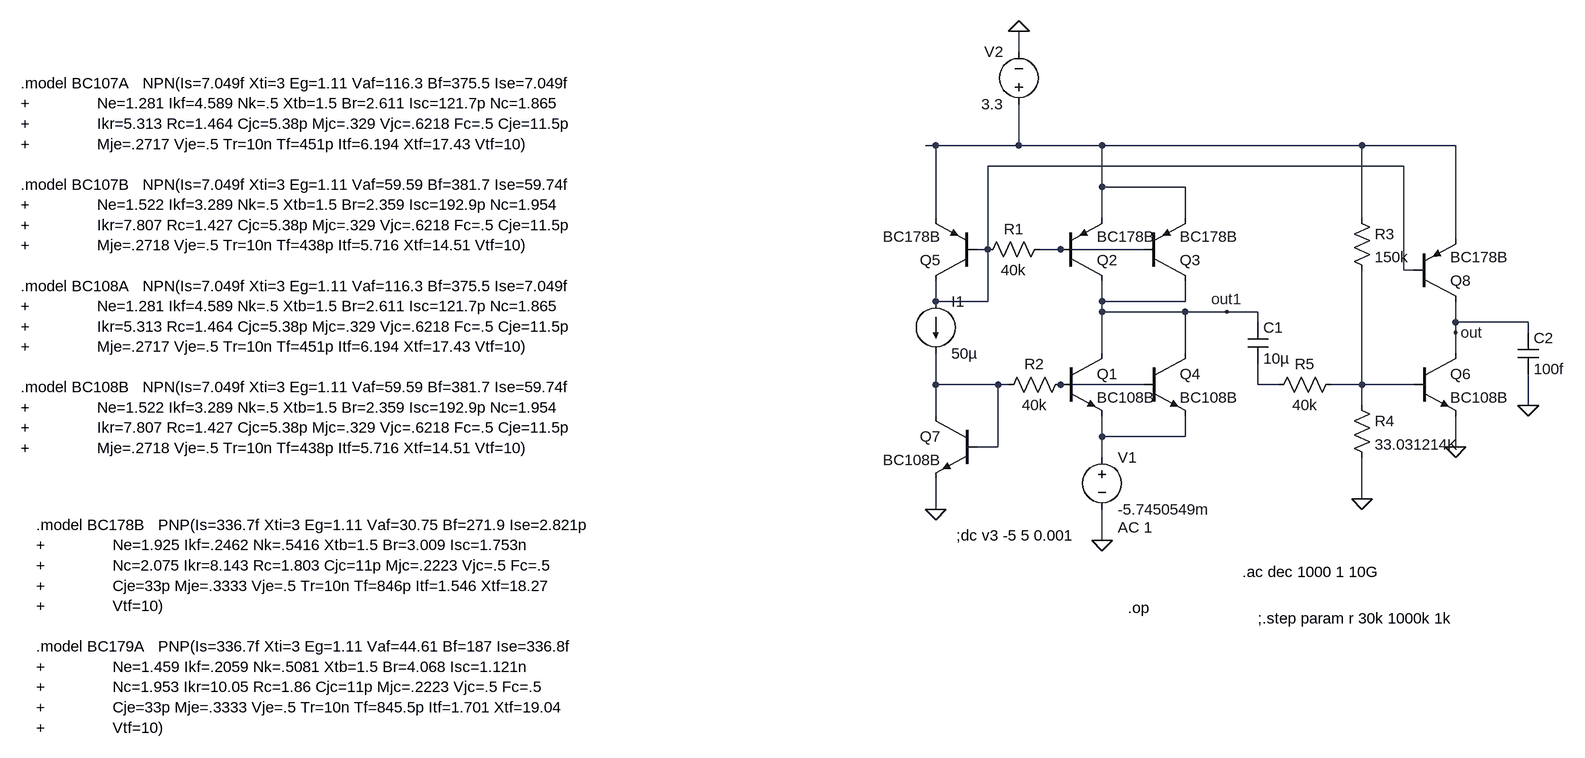
[diagram p0: schematic BJT.asc]
BJT.asc, the LTspice schematic file:
Version 4
SHEET 1 1180 704
WIRE 112 -320 112 -352
WIRE -16 -176 -32 -176
WIRE 112 -176 112 -240
WIRE 112 -176 -16 -176
WIRE 240 -176 112 -176
WIRE 640 -176 240 -176
WIRE 784 -176 640 -176
WIRE 704 -144 64 -144
WIRE 240 -112 240 -176
WIRE 368 -112 240 -112
WIRE -16 -64 -16 -176
WIRE 240 -64 240 -112
WIRE 368 -64 368 -112
WIRE 640 -64 640 -176
WIRE 784 -32 784 -176
WIRE 64 -16 64 -144
WIRE 64 -16 48 -16
WIRE 176 -16 144 -16
WIRE 304 -16 176 -16
WIRE 704 16 704 -144
WIRE 720 16 704 16
WIRE -16 64 -16 32
WIRE 64 64 64 -16
WIRE 64 64 -16 64
WIRE 240 64 240 32
WIRE 368 64 368 32
WIRE 368 64 240 64
WIRE 240 80 240 64
WIRE 368 80 240 80
WIRE 432 80 368 80
WIRE 480 80 432 80
WIRE 480 96 480 80
WIRE 784 96 784 64
WIRE 896 96 784 96
WIRE 784 112 784 96
WIRE 896 112 896 96
WIRE 240 144 240 80
WIRE 368 144 368 80
WIRE 784 144 784 112
WIRE -16 192 -16 144
WIRE 80 192 -16 192
WIRE 96 192 80 192
WIRE 304 192 176 192
WIRE 480 192 480 160
WIRE 512 192 480 192
WIRE 640 192 640 16
WIRE 640 192 592 192
WIRE 720 192 640 192
WIRE 640 224 640 192
WIRE 896 224 896 176
WIRE -16 240 -16 192
WIRE 240 272 240 240
WIRE 368 272 368 240
WIRE 368 272 240 272
WIRE 80 288 80 192
WIRE 80 288 48 288
WIRE 784 288 784 240
WIRE 240 304 240 272
WIRE 640 368 640 304
WIRE -16 384 -16 336
WIRE 240 432 240 384
FLAG 240 432 0
FLAG -16 384 0
FLAG 112 -352 0
FLAG 784 288 0
FLAG 640 368 0
FLAG 432 80 out1
FLAG 784 112 out
FLAG 896 224 0
SYMBOL npn 176 144 R0
SYMATTR InstName Q1
SYMATTR Value BC108B
SYMBOL pnp 176 32 M180
SYMATTR InstName Q2
SYMATTR Value BC178B
SYMBOL voltage 240 288 R0
WINDOW 123 24 124 Left 2
WINDOW 39 0 0 Left 0
SYMATTR Value2 AC 1
SYMATTR InstName V1
SYMATTR Value -5.7450549m
SYMBOL res 160 -32 R90
WINDOW 0 0 56 VBottom 2
WINDOW 3 32 56 VTop 2
SYMATTR InstName R1
SYMATTR Value 40k
SYMBOL pnp 48 32 R180
SYMATTR InstName Q5
SYMATTR Value BC178B
SYMBOL current -16 64 R0
WINDOW 123 0 0 Left 0
WINDOW 39 0 0 Left 0
SYMATTR InstName I1
SYMATTR Value 50µ
SYMBOL npn 48 240 M0
SYMATTR InstName Q7
SYMATTR Value BC108B
SYMBOL res 192 176 R90
WINDOW 0 0 56 VBottom 2
WINDOW 3 32 56 VTop 2
SYMATTR InstName R2
SYMATTR Value 40k
SYMBOL voltage 112 -224 R180
WINDOW 0 24 96 Left 2
WINDOW 3 24 16 Left 2
WINDOW 123 0 0 Left 0
WINDOW 39 0 0 Left 0
SYMATTR InstName V2
SYMATTR Value 3.3
SYMBOL pnp 304 32 M180
SYMATTR InstName Q3
SYMATTR Value BC178B
SYMBOL npn 304 144 R0
SYMATTR InstName Q4
SYMATTR Value BC108B
SYMBOL npn 720 144 R0
SYMATTR InstName Q6
SYMATTR Value BC108B
SYMBOL pnp 720 64 M180
SYMATTR InstName Q8
SYMATTR Value BC178B
SYMBOL res 624 -80 R0
SYMATTR InstName R3
SYMATTR Value 150k
SYMBOL res 624 208 R0
SYMATTR InstName R4
SYMATTR Value 33.031214K
SYMBOL res 608 176 R90
WINDOW 0 0 56 VBottom 2
WINDOW 3 32 56 VTop 2
SYMATTR InstName R5
SYMATTR Value 40k
SYMBOL cap 464 96 R0
SYMATTR InstName C1
SYMATTR Value 10µ
SYMBOL cap 880 112 R0
SYMATTR InstName C2
SYMATTR Value 100f
TEXT -1424 -272 Left 2 !.model BC107A   NPN(Is=7.049f Xti=3 Eg=1.11 Vaf=116.3 Bf=375.5 Ise=7.049f\n+               Ne=1.281 Ikf=4.589 Nk=.5 Xtb=1.5 Br=2.611 Isc=121.7p Nc=1.865\n+               Ikr=5.313 Rc=1.464 Cjc=5.38p Mjc=.329 Vjc=.6218 Fc=.5 Cje=11.5p\n+               Mje=.2717 Vje=.5 Tr=10n Tf=451p Itf=6.194 Xtf=17.43 Vtf=10)\n \n.model BC107B   NPN(Is=7.049f Xti=3 Eg=1.11 Vaf=59.59 Bf=381.7 Ise=59.74f\n+               Ne=1.522 Ikf=3.289 Nk=.5 Xtb=1.5 Br=2.359 Isc=192.9p Nc=1.954\n+               Ikr=7.807 Rc=1.427 Cjc=5.38p Mjc=.329 Vjc=.6218 Fc=.5 Cje=11.5p\n+               Mje=.2718 Vje=.5 Tr=10n Tf=438p Itf=5.716 Xtf=14.51 Vtf=10)\n \n.model BC108A   NPN(Is=7.049f Xti=3 Eg=1.11 Vaf=116.3 Bf=375.5 Ise=7.049f\n+               Ne=1.281 Ikf=4.589 Nk=.5 Xtb=1.5 Br=2.611 Isc=121.7p Nc=1.865\n+               Ikr=5.313 Rc=1.464 Cjc=5.38p Mjc=.329 Vjc=.6218 Fc=.5 Cje=11.5p\n+               Mje=.2717 Vje=.5 Tr=10n Tf=451p Itf=6.194 Xtf=17.43 Vtf=10)\n \n.model BC108B   NPN(Is=7.049f Xti=3 Eg=1.11 Vaf=59.59 Bf=381.7 Ise=59.74f\n+               Ne=1.522 Ikf=3.289 Nk=.5 Xtb=1.5 Br=2.359 Isc=192.9p Nc=1.954\n+               Ikr=7.807 Rc=1.427 Cjc=5.38p Mjc=.329 Vjc=.6218 Fc=.5 Cje=11.5p\n+               Mje=.2718 Vje=.5 Tr=10n Tf=438p Itf=5.716 Xtf=14.51 Vtf=10)
TEXT -1400 408 Left 2 !.model BC178B   PNP(Is=336.7f Xti=3 Eg=1.11 Vaf=30.75 Bf=271.9 Ise=2.821p\n+               Ne=1.925 Ikf=.2462 Nk=.5416 Xtb=1.5 Br=3.009 Isc=1.753n\n+               Nc=2.075 Ikr=8.143 Rc=1.803 Cjc=11p Mjc=.2223 Vjc=.5 Fc=.5\n+               Cje=33p Mje=.3333 Vje=.5 Tr=10n Tf=846p Itf=1.546 Xtf=18.27\n+               Vtf=10)\n \n.model BC179A   PNP(Is=336.7f Xti=3 Eg=1.11 Vaf=44.61 Bf=187 Ise=336.8f\n+               Ne=1.459 Ikf=.2059 Nk=.5081 Xtb=1.5 Br=4.068 Isc=1.121n\n+               Nc=1.953 Ikr=10.05 Rc=1.86 Cjc=11p Mjc=.2223 Vjc=.5 Fc=.5\n+               Cje=33p Mje=.3333 Vje=.5 Tr=10n Tf=845.5p Itf=1.701 Xtf=19.04\n+               Vtf=10)
TEXT 16 424 Left 2 !;dc v3 -5 5 0.001
TEXT 456 480 Left 2 !.ac dec 1000 1 10G
TEXT 280 536 Left 2 !.op
TEXT 480 552 Left 2 !;.step param r 30k 1000k 1k

The netlist it stands for:
* BJT.asc
Q1 out1 N005 N008 0 BC108B
Q2 out1 N003 N001 0 BC178B
V1 N008 0 -5.7450549m AC 1
R1 N003 N002 40k
Q5 N002 N002 N001 0 BC178B
I1 N002 N004 50µ
Q7 N004 N004 0 0 BC108B
R2 N005 N004 40k
V2 N001 0 3.3
Q3 out1 N003 N001 0 BC178B
Q4 out1 N005 N008 0 BC108B
Q6 out N007 0 0 BC108B
Q8 out N002 N001 0 BC178B
R3 N001 N007 150k
R4 N007 0 33.031214K
R5 N007 N006 40k
C1 out1 N006 10µ
C2 out 0 100f
.model NPN NPN
.model PNP PNP
.lib standard.bjt
.model BC107A   NPN(Is=7.049f Xti=3 Eg=1.11 Vaf=116.3 Bf=375.5 Ise=7.049f
+               Ne=1.281 Ikf=4.589 Nk=.5 Xtb=1.5 Br=2.611 Isc=121.7p Nc=1.865
+               Ikr=5.313 Rc=1.464 Cjc=5.38p Mjc=.329 Vjc=.6218 Fc=.5 Cje=11.5p
+               Mje=.2717 Vje=.5 Tr=10n Tf=451p Itf=6.194 Xtf=17.43 Vtf=10)
.model BC107B   NPN(Is=7.049f Xti=3 Eg=1.11 Vaf=59.59 Bf=381.7 Ise=59.74f
+               Ne=1.522 Ikf=3.289 Nk=.5 Xtb=1.5 Br=2.359 Isc=192.9p Nc=1.954
+               Ikr=7.807 Rc=1.427 Cjc=5.38p Mjc=.329 Vjc=.6218 Fc=.5 Cje=11.5p
+               Mje=.2718 Vje=.5 Tr=10n Tf=438p Itf=5.716 Xtf=14.51 Vtf=10)
.model BC108A   NPN(Is=7.049f Xti=3 Eg=1.11 Vaf=116.3 Bf=375.5 Ise=7.049f
+               Ne=1.281 Ikf=4.589 Nk=.5 Xtb=1.5 Br=2.611 Isc=121.7p Nc=1.865
+               Ikr=5.313 Rc=1.464 Cjc=5.38p Mjc=.329 Vjc=.6218 Fc=.5 Cje=11.5p
+               Mje=.2717 Vje=.5 Tr=10n Tf=451p Itf=6.194 Xtf=17.43 Vtf=10)
.model BC108B   NPN(Is=7.049f Xti=3 Eg=1.11 Vaf=59.59 Bf=381.7 Ise=59.74f
+               Ne=1.522 Ikf=3.289 Nk=.5 Xtb=1.5 Br=2.359 Isc=192.9p Nc=1.954
+               Ikr=7.807 Rc=1.427 Cjc=5.38p Mjc=.329 Vjc=.6218 Fc=.5 Cje=11.5p
+               Mje=.2718 Vje=.5 Tr=10n Tf=438p Itf=5.716 Xtf=14.51 Vtf=10)
.model BC178B   PNP(Is=336.7f Xti=3 Eg=1.11 Vaf=30.75 Bf=271.9 Ise=2.821p
+               Ne=1.925 Ikf=.2462 Nk=.5416 Xtb=1.5 Br=3.009 Isc=1.753n
+               Nc=2.075 Ikr=8.143 Rc=1.803 Cjc=11p Mjc=.2223 Vjc=.5 Fc=.5
+               Cje=33p Mje=.3333 Vje=.5 Tr=10n Tf=846p Itf=1.546 Xtf=18.27
+               Vtf=10)
.model BC179A   PNP(Is=336.7f Xti=3 Eg=1.11 Vaf=44.61 Bf=187 Ise=336.8f
+               Ne=1.459 Ikf=.2059 Nk=.5081 Xtb=1.5 Br=4.068 Isc=1.121n
+               Nc=1.953 Ikr=10.05 Rc=1.86 Cjc=11p Mjc=.2223 Vjc=.5 Fc=.5
+               Cje=33p Mje=.3333 Vje=.5 Tr=10n Tf=845.5p Itf=1.701 Xtf=19.04
+               Vtf=10)
;dc v3 -5 5 0.001
.ac dec 1000 1 10G
.op
;.step param r 30k 1000k 1k
.backanno
.end